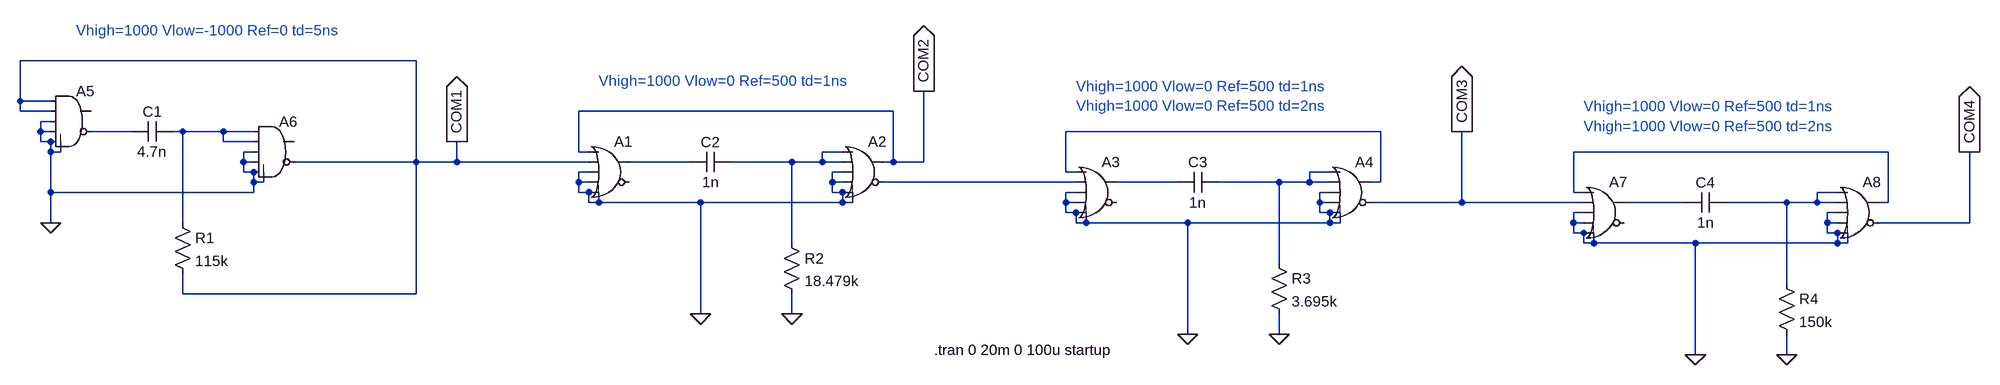
[diagram p0: schematic Multivibrateur-stable-OR.asc]
Multivibrateur-stable-OR.asc, the LTspice schematic file:
Version 4.1
SHEET 1 2280 680
WIRE -240 -32 -864 -32
WIRE -864 32 -864 -32
WIRE -816 32 -864 32
WIRE -864 48 -864 32
WIRE -816 48 -864 48
WIRE 512 48 16 48
WIRE -816 64 -832 64
WIRE -832 80 -832 64
WIRE -816 80 -832 80
WIRE -688 80 -752 80
WIRE -608 80 -624 80
WIRE -544 80 -608 80
WIRE -496 80 -544 80
WIRE 1280 80 784 80
WIRE -832 96 -832 80
WIRE -816 96 -832 96
WIRE -544 96 -544 80
WIRE -496 96 -544 96
WIRE -816 112 -816 96
WIRE -800 112 -800 96
WIRE -800 112 -816 112
WIRE -496 112 -512 112
WIRE 16 112 16 48
WIRE 32 112 16 112
WIRE 432 112 400 112
WIRE 2080 112 1584 112
WIRE -512 128 -512 112
WIRE -496 128 -512 128
WIRE -240 128 -240 -32
WIRE -240 128 -432 128
WIRE -176 128 -176 96
WIRE -176 128 -240 128
WIRE 32 128 -176 128
WIRE 192 128 96 128
WIRE 352 128 256 128
WIRE 400 128 400 112
WIRE 400 128 352 128
WIRE 432 128 400 128
WIRE 512 128 512 48
WIRE 512 128 496 128
WIRE 560 128 560 16
WIRE 560 128 512 128
WIRE -512 144 -512 128
WIRE -496 144 -512 144
WIRE 32 144 16 144
WIRE 432 144 416 144
WIRE 784 144 784 80
WIRE 800 144 784 144
WIRE 1200 144 1168 144
WIRE -496 160 -496 144
WIRE -480 160 -480 144
WIRE -480 160 -496 160
WIRE 16 160 16 144
WIRE 32 160 16 160
WIRE 416 160 416 144
WIRE 432 160 416 160
WIRE 800 160 496 160
WIRE 960 160 864 160
WIRE 1120 160 1024 160
WIRE 1168 160 1168 144
WIRE 1168 160 1120 160
WIRE 1200 160 1168 160
WIRE 1280 160 1280 80
WIRE 1280 160 1264 160
WIRE -816 176 -816 112
WIRE -496 176 -496 160
WIRE -496 176 -816 176
WIRE 16 176 16 160
WIRE 32 176 16 176
WIRE 416 176 416 160
WIRE 432 176 416 176
WIRE 800 176 784 176
WIRE 1200 176 1184 176
WIRE 1584 176 1584 112
WIRE 1600 176 1584 176
WIRE 2000 176 1968 176
WIRE 32 192 32 176
WIRE 48 192 48 176
WIRE 48 192 32 192
WIRE 208 192 48 192
WIRE 432 192 432 176
WIRE 432 192 208 192
WIRE 448 192 448 176
WIRE 448 192 432 192
WIRE 784 192 784 176
WIRE 800 192 784 192
WIRE 1184 192 1184 176
WIRE 1200 192 1184 192
WIRE 1408 192 1408 80
WIRE 1408 192 1264 192
WIRE 1600 192 1408 192
WIRE 1760 192 1664 192
WIRE 1920 192 1824 192
WIRE 1968 192 1968 176
WIRE 1968 192 1920 192
WIRE 2000 192 1968 192
WIRE 2080 192 2080 112
WIRE 2080 192 2064 192
WIRE 784 208 784 192
WIRE 800 208 784 208
WIRE 1184 208 1184 192
WIRE 1200 208 1184 208
WIRE 1600 208 1584 208
WIRE 2000 208 1984 208
WIRE -816 224 -816 176
WIRE -608 224 -608 80
WIRE 800 224 800 208
WIRE 816 224 816 208
WIRE 816 224 800 224
WIRE 976 224 816 224
WIRE 1200 224 1200 208
WIRE 1200 224 976 224
WIRE 1216 224 1216 208
WIRE 1216 224 1200 224
WIRE 1584 224 1584 208
WIRE 1600 224 1584 224
WIRE 1984 224 1984 208
WIRE 2000 224 1984 224
WIRE 2208 224 2208 112
WIRE 2208 224 2064 224
WIRE 1584 240 1584 224
WIRE 1600 240 1584 240
WIRE 1984 240 1984 224
WIRE 2000 240 1984 240
WIRE 352 256 352 128
WIRE 1600 256 1600 240
WIRE 1616 256 1616 240
WIRE 1616 256 1600 256
WIRE 1776 256 1616 256
WIRE 2000 256 2000 240
WIRE 2000 256 1776 256
WIRE 2016 256 2016 240
WIRE 2016 256 2000 256
WIRE 1120 288 1120 160
WIRE 1920 320 1920 192
WIRE -608 336 -608 304
WIRE -240 336 -240 128
WIRE -240 336 -608 336
WIRE 208 368 208 192
WIRE 352 368 352 336
WIRE 976 400 976 224
WIRE 1120 400 1120 368
WIRE 1776 432 1776 256
WIRE 1920 432 1920 400
FLAG 208 368 0
FLAG 352 368 0
FLAG 976 400 0
FLAG 1120 400 0
FLAG 560 16 COM2
IOPIN 560 16 Out
FLAG 1408 80 COM3
IOPIN 1408 80 Out
FLAG -816 224 0
FLAG -176 96 COM1
IOPIN -176 96 Out
FLAG 1776 432 0
FLAG 1920 432 0
FLAG 2208 112 COM4
IOPIN 2208 112 Out
SYMBOL Digital\\or 64 80 R0
WINDOW 3 -8 36 Invisible 2
SYMATTR Value Vhigh=1000 Vlow=0 Ref=500 td=1ns
SYMATTR InstName A1
SYMBOL Digital\\or 464 80 R0
WINDOW 3 -8 128 Invisible 2
SYMATTR Value Vhigh=1000 Vlow=0 Ref=500 td=1ns
SYMATTR InstName A2
SYMBOL cap 256 112 R90
WINDOW 0 0 32 VBottom 2
WINDOW 3 32 32 VTop 2
SYMATTR InstName C2
SYMATTR Value 1n
SYMBOL res 336 240 R0
SYMATTR InstName R2
SYMATTR Value 18.479k
SYMBOL Digital\\or 832 112 R0
WINDOW 3 -8 36 Invisible 2
SYMATTR Value Vhigh=1000 Vlow=0 Ref=500 td=1ns
SYMATTR InstName A3
SYMBOL Digital\\or 1232 112 R0
WINDOW 3 -8 128 Invisible 2
SYMATTR Value Vhigh=1000 Vlow=0 Ref=500 td=2ns
SYMATTR InstName A4
SYMBOL cap 1024 144 R90
WINDOW 0 0 32 VBottom 2
WINDOW 3 32 32 VTop 2
SYMATTR InstName C3
SYMATTR Value 1n
SYMBOL res 1104 272 R0
SYMATTR InstName R3
SYMATTR Value 3.695k
SYMBOL Digital\\and -784 0 R0
WINDOW 3 16 112 Invisible 2
SYMATTR Value Vhigh=1k Vlow=-1k Ref=0
SYMATTR InstName A5
SYMBOL Digital\\and -464 48 R0
WINDOW 3 16 112 Invisible 2
SYMATTR Value Vhigh=1k Vlow=-1k Ref=0 td=5ns
SYMATTR InstName A6
SYMBOL cap -624 64 R90
WINDOW 0 0 32 VBottom 2
WINDOW 3 32 32 VTop 2
SYMATTR InstName C1
SYMATTR Value 4.7n
SYMBOL res -624 208 R0
SYMATTR InstName R1
SYMATTR Value 115k
SYMBOL Digital\\or 1632 144 R0
WINDOW 3 -8 36 Invisible 2
SYMATTR Value Vhigh=1000 Vlow=0 Ref=500 td=1ns
SYMATTR InstName A7
SYMBOL Digital\\or 2032 144 R0
WINDOW 3 -8 128 Invisible 2
SYMATTR Value Vhigh=1000 Vlow=0 Ref=500 td=2ns
SYMATTR InstName A8
SYMBOL cap 1824 176 R90
WINDOW 0 0 32 VBottom 2
WINDOW 3 32 32 VTop 2
SYMATTR InstName C4
SYMATTR Value 1n
SYMBOL res 1904 304 R0
SYMATTR InstName R4
SYMATTR Value 150k
TEXT 576 424 Left 2 !.tran 0 20m 0 100u startup
TEXT 800 8 Left 2 ;Vhigh=1000 Vlow=0 Ref=500 td=1ns\nVhigh=1000 Vlow=0 Ref=500 td=2ns
TEXT 48 0 Left 2 ;Vhigh=1000 Vlow=0 Ref=500 td=1ns
TEXT -776 -80 Left 2 ;Vhigh=1000 Vlow=-1000 Ref=0 td=5ns
TEXT 1600 40 Left 2 ;Vhigh=1000 Vlow=0 Ref=500 td=1ns\nVhigh=1000 Vlow=0 Ref=500 td=2ns

The netlist it stands for:
* Multivibrateur-stable-OR.asc
A1 COM2 COM1 0 0 0 0 N006 0 OR Vhigh=1000 Vlow=0 Ref=500 td=1ns
A2 N004 N004 0 0 0 N008 COM2 0 OR Vhigh=1000 Vlow=0 Ref=500 td=1ns
C2 N004 N006 1n
R2 N004 0 18.479k
A3 N003 N008 0 0 0 0 N009 0 OR Vhigh=1000 Vlow=0 Ref=500 td=1ns
A4 N007 N007 0 0 0 COM3 N003 0 OR Vhigh=1000 Vlow=0 Ref=500 td=2ns
C3 N007 N009 1n
R3 N007 0 3.695k
A5 COM1 COM1 0 0 0 N001 0 0 AND Vhigh=1k Vlow=-1k Ref=0
A6 N002 N002 0 0 0 COM1 0 0 AND Vhigh=1k Vlow=-1k Ref=0 td=5ns
C1 N002 N001 4.7n
R1 N002 COM1 115k
A7 N005 COM3 0 0 0 0 N011 0 OR Vhigh=1000 Vlow=0 Ref=500 td=1ns
A8 N010 N010 0 0 0 COM4 N005 0 OR Vhigh=1000 Vlow=0 Ref=500 td=2ns
C4 N010 N011 1n
R4 N010 0 150k
.tran 0 20m 0 100u startup
* Vhigh=1000 Vlow=0 Ref=500 td=1ns
* Vhigh=1000 Vlow=0 Ref=500 td=2ns
* Vhigh=1000 Vlow=0 Ref=500 td=1ns
* Vhigh=1000 Vlow=-1000 Ref=0 td=5ns
* Vhigh=1000 Vlow=0 Ref=500 td=1ns
* Vhigh=1000 Vlow=0 Ref=500 td=2ns
.backanno
.end